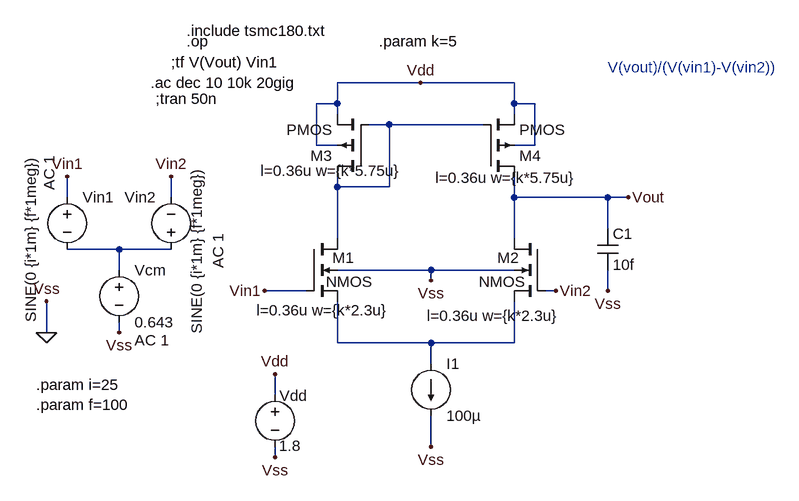
[diagram p0: schematic OP_AMP_1_10GHZ.asc]
OP_AMP_1_10GHZ.asc, the LTspice schematic file:
Version 4
SHEET 1 1344 680
WIRE 752 -64 624 -64
WIRE 896 -64 752 -64
WIRE 624 -32 624 -64
WIRE 624 -32 592 -32
WIRE 896 -32 896 -64
WIRE 928 -32 896 -32
WIRE 624 -16 624 -32
WIRE 896 -16 896 -32
WIRE 704 0 672 0
WIRE 848 0 704 0
WIRE 592 32 592 -32
WIRE 624 32 592 32
WIRE 928 32 928 -32
WIRE 928 32 896 32
WIRE 624 96 624 80
WIRE 704 96 704 0
WIRE 704 96 624 96
WIRE 208 112 208 80
WIRE 368 112 368 80
WIRE 896 112 896 80
WIRE 1040 112 896 112
WIRE 1072 112 1040 112
WIRE 1040 160 1040 112
WIRE 624 176 624 96
WIRE 896 176 896 112
WIRE 288 192 208 192
WIRE 368 192 288 192
WIRE 288 224 288 192
WIRE 768 224 624 224
WIRE 896 224 768 224
WIRE 768 240 768 224
WIRE 576 256 512 256
WIRE 960 256 944 256
WIRE 1040 256 1040 224
WIRE 176 320 176 272
WIRE 288 320 288 304
WIRE 624 336 624 272
WIRE 768 336 624 336
WIRE 896 336 896 272
WIRE 896 336 768 336
WIRE 768 368 768 336
WIRE 528 416 528 384
WIRE 768 496 768 448
WIRE 528 512 528 496
FLAG 176 320 0
FLAG 176 272 Vss
FLAG 528 512 Vss
FLAG 288 320 Vss
FLAG 528 384 Vdd
FLAG 512 256 Vin1
FLAG 752 -64 Vdd
FLAG 960 256 Vin2
FLAG 768 496 Vss
FLAG 768 240 Vss
FLAG 208 80 Vin1
FLAG 368 80 Vin2
FLAG 1040 256 Vss
FLAG 1072 112 Vout
SYMBOL nmos4 576 176 R0
WINDOW 0 40 29 Left 2
WINDOW 3 30 66 Left 2
WINDOW 123 127 110 Right 2
SYMATTR InstName M1
SYMATTR Value2 l=0.36u w={k*2.3u}
SYMBOL voltage 528 400 R0
WINDOW 123 0 0 Left 0
WINDOW 39 0 0 Left 0
WINDOW 0 7 17 Left 2
WINDOW 3 6 94 Left 2
SYMATTR InstName Vdd
SYMATTR Value 1.8
SYMBOL nmos4 944 176 M0
WINDOW 0 40 29 Left 2
WINDOW 3 30 66 Left 2
WINDOW 123 -21 118 Left 2
SYMATTR InstName M2
SYMATTR Value2 l=0.36u w={k*2.3u}
SYMBOL current 768 368 R0
WINDOW 123 0 0 Left 0
WINDOW 39 0 0 Left 0
SYMATTR InstName I1
SYMATTR Value 100µ
SYMBOL voltage 288 208 R0
WINDOW 123 24 124 Left 2
WINDOW 39 0 0 Left 0
SYMATTR Value2 AC 1
SYMATTR InstName Vcm
SYMATTR Value 0.643
SYMBOL voltage 208 96 R0
WINDOW 3 -56 -48 VRight 2
WINDOW 123 -28 -48 VRight 2
WINDOW 39 0 0 Left 0
SYMATTR Value SINE(0 {i*1m} {f*1meg})
SYMATTR Value2 AC 1
SYMATTR InstName Vin1
SYMBOL voltage 368 208 R180
WINDOW 0 24 96 Left 2
WINDOW 3 -39 -114 VRight 2
WINDOW 123 -72 -13 VRight 2
WINDOW 39 0 0 Left 0
SYMATTR InstName Vin2
SYMATTR Value SINE(0 {i*1m} {f*1meg})
SYMATTR Value2 AC 1
SYMBOL pmos4 672 80 R180
WINDOW 123 -50 9 Left 2
SYMATTR Value2 l=0.36u w={k*5.75u}
SYMATTR InstName M3
SYMBOL pmos4 848 80 M180
WINDOW 123 -73 -2 Left 2
SYMATTR Value2 l=0.36u w={k*5.75u}
SYMATTR InstName M4
SYMBOL cap 1024 160 R0
SYMATTR InstName C1
SYMATTR Value 10f
TEXT 392 -144 Left 2 !.include tsmc180.txt
TEXT 392 -128 Left 2 !.op
TEXT 368 -96 Left 2 !;tf V(Vout) Vin1
TEXT 336 -64 Left 2 !.ac dec 10 10k 20gig
TEXT 344 -40 Left 2 !;tran 50n
TEXT 688 -128 Left 2 !.param k=5
TEXT 160 400 Left 2 !.param i=25\n.param f=100
TEXT 1040 -88 Left 2 ;V(vout)/(V(vin1)-V(vin2))

The netlist it stands for:
* OP_AMP_1_10GHZ.asc
M1 N001 Vin1 N003 0 NMOS l=0.36u w={k*2.3u}
Vdd Vdd 0 1.8
M2 Vout Vin2 N003 0 NMOS l=0.36u w={k*2.3u}
I1 N003 0 100µ
Vcm N002 0 0.643 AC 1
Vin1 Vin1 N002 SINE(0 {i*1m} {f*1meg}) AC 1
Vin2 N002 Vin2 SINE(0 {i*1m} {f*1meg}) AC 1
M3 N001 N001 Vdd Vdd PMOS l=0.36u w={k*5.75u}
M4 Vout N001 Vdd Vdd PMOS l=0.36u w={k*5.75u}
C1 Vout 0 10f
.model NMOS NMOS
.model PMOS PMOS
.lib standard.mos
.include tsmc180.txt
.op
;tf V(Vout) Vin1
.ac dec 10 10k 20gig
;tran 50n
.param k=5
.param i=25
.param f=100
* V(vout)/(V(vin1)-V(vin2))
.backanno
.end